# EAGLE schematic esp_sense (EAGLE 9.3.0)
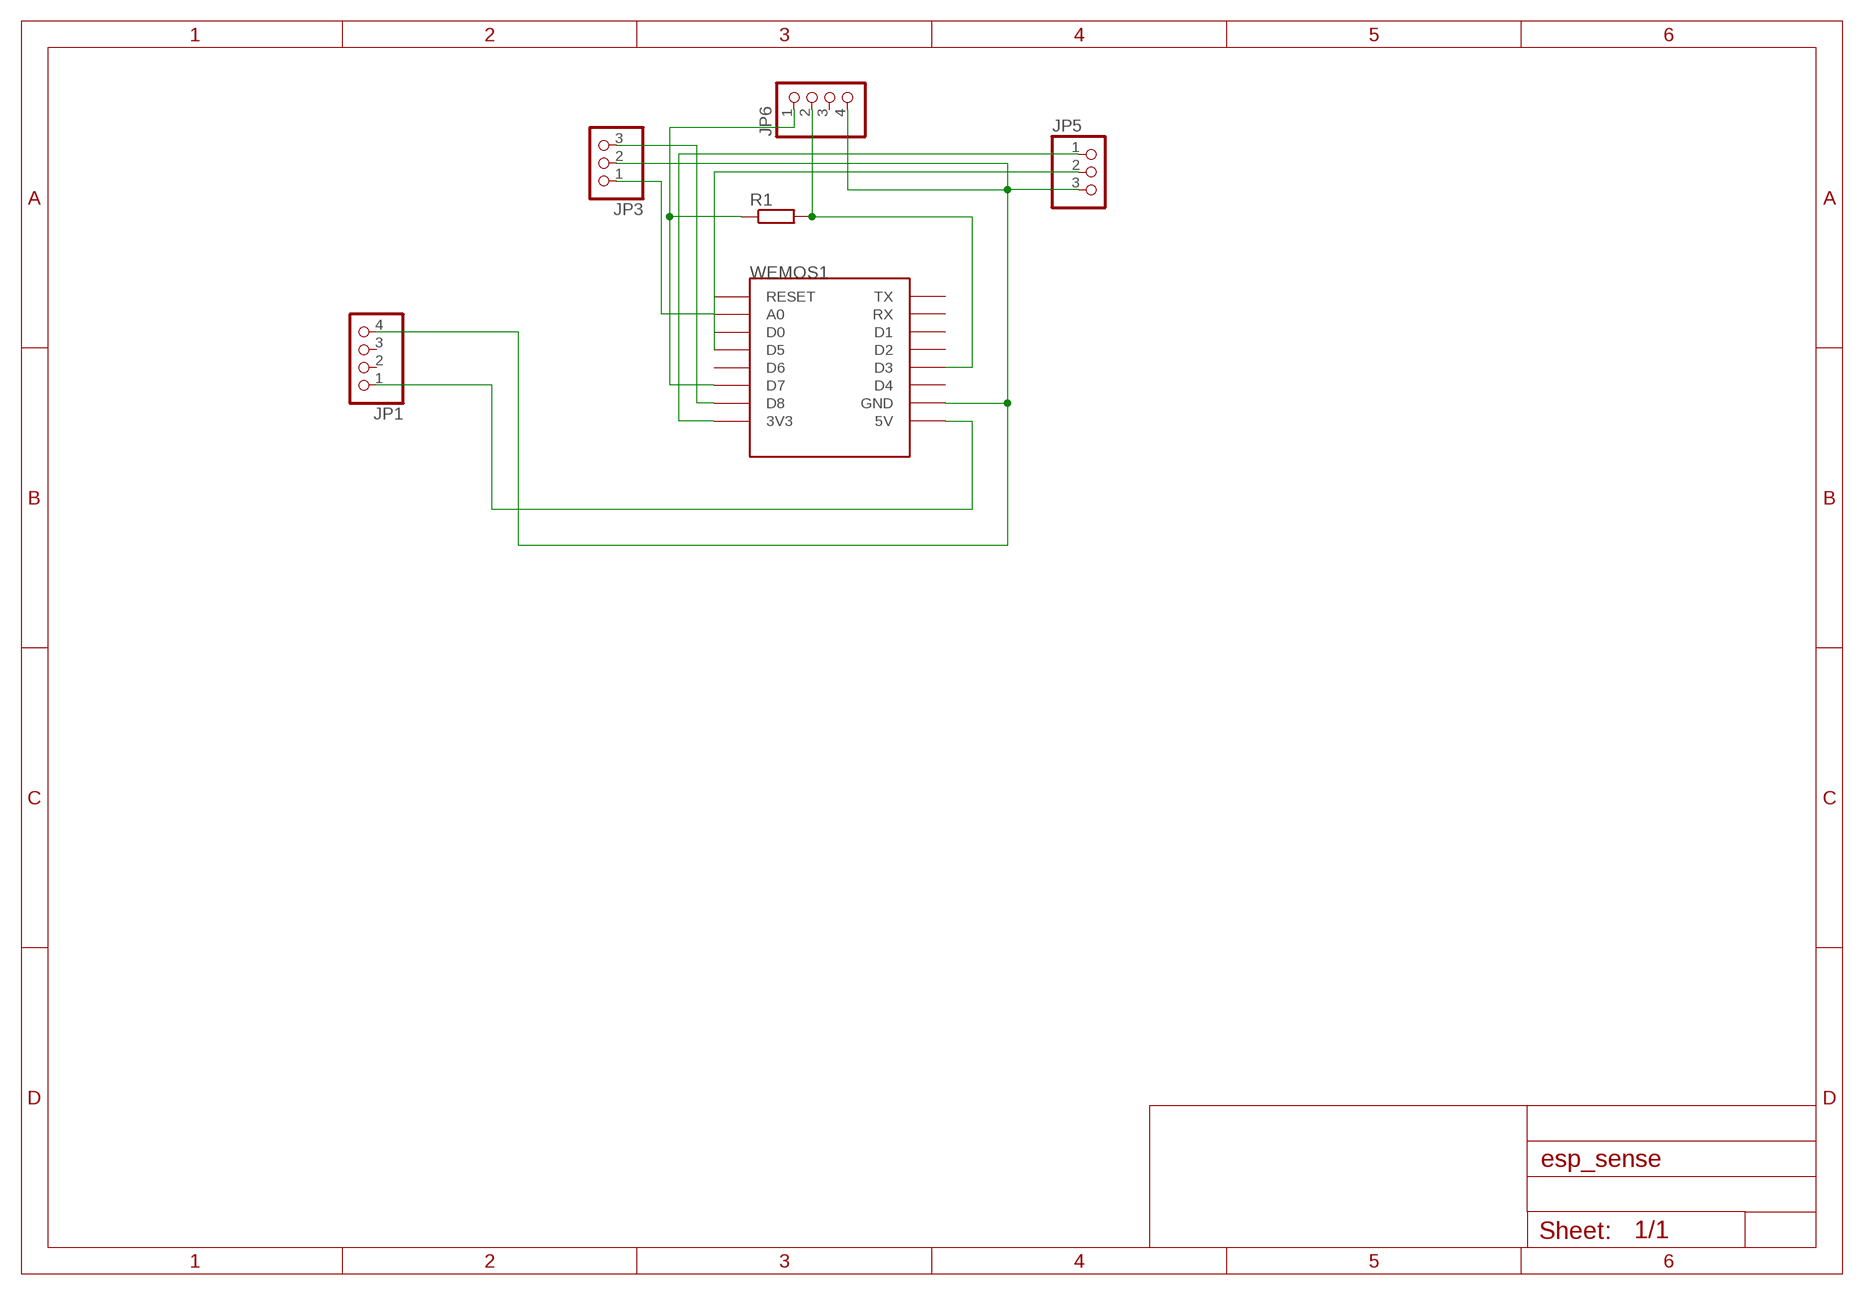
[diagram p0: schematic, sheet 1]

## Parts
JP1  PINHD-1X4  [1X04]
JP3  PINHD-1X3  [1X03]
JP5  PINHD-1X3  [1X03]
JP6  PINHD-1X4  [1X04]
R1  R-EU_0207/2V  [0207/2V]
WEMOS1  WEMOS-D1-MINI  [WEMOS-D1-MINI]

## Nets
GND: JP1.4 JP3.2 JP5.3 JP6.4 WEMOS1.GND
N$1: JP1.1 WEMOS1.5V
N$10: JP6.2 R1.2 WEMOS1.D3
N$12: JP3.1 WEMOS1.A0
N$14: JP5.2 WEMOS1.D5
N$16: JP6.1 R1.1 WEMOS1.D7
N$17: JP3.3 WEMOS1.D8
N$18: JP5.1 WEMOS1.3V3
Unconnected: JP1.2 JP1.3 JP6.3 WEMOS1.D0 WEMOS1.D1 WEMOS1.D2 WEMOS1.D4 WEMOS1.D6 WEMOS1.RESET WEMOS1.RX WEMOS1.TX

## Library data of the parts
JP1 JP6 = pinhead:PINHD-1X4: PIN HEADER
JP3 JP5 = pinhead:PINHD-1X3: PIN HEADER
R1 = rcl:R-EU_: RESISTOR, European symbol; SPICEPREFIX: R
WEMOS1 = SWI_COMMONS:WEMOS-D1-MINI: WeMos.cc D1 mini ESP8266 module